# EAGLE design signal_mux (EAGLE 5.09)
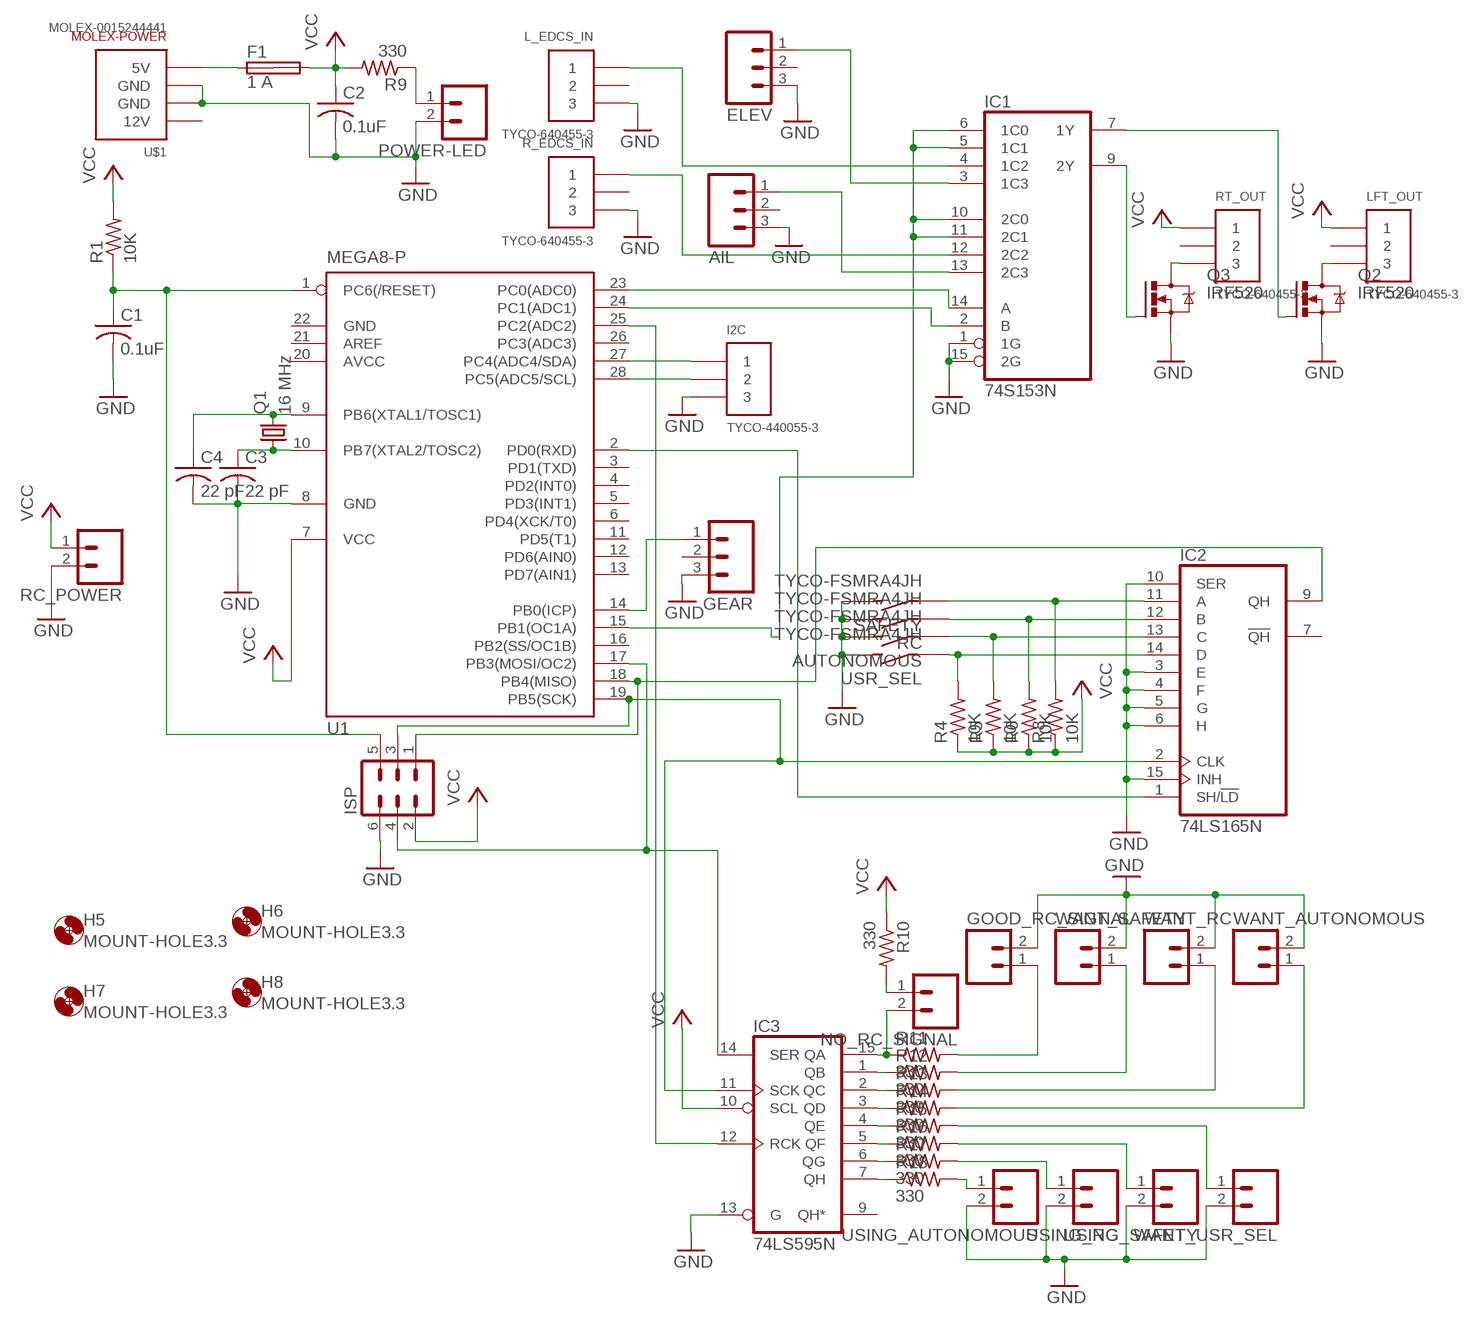
[diagram p0: schematic, sheet 1]

## Parts
AIL  M03POLAR  [MOLEX-1X3]
AUTONOMOUS  TYCO-FSMRA4JH  [TYCO-FSMRA4JH]
C1  0.1uF  C-US050-055X075  [C050-055X075]
C2  0.1uF  C-US050-055X075  [C050-055X075]
C3  22 pF  C-US025-025X050  [C025-025X050]
C4  22 pF  C-US025-025X050  [C025-025X050]
ELEV  M03POLAR  [MOLEX-1X3]
F1  1 A  SHK20Q  [SHK20Q]
GEAR  M03POLAR  [MOLEX-1X3]
GOOD_RC_SIGNAL  M02POLAR  [MOLEX-1X2]
H5  MOUNT-HOLE3.3  [3,3]
H6  MOUNT-HOLE3.3  [3,3]
H7  MOUNT-HOLE3.3  [3,3]
H8  MOUNT-HOLE3.3  [3,3]
I2C  TYCO-440055-3  [HEADER-RA-2.00MM-3]
IC1  74S153N  [DIL16]
IC2  74LS165N  [DIL16]
IC3  74LS595N  [DIL16]
ISP  MA03-2  [MA03-2]
L_EDCS_IN  TYCO-640455-3  [HEADER-RA-POL-.100IN-3]
LFT_OUT  TYCO-640455-3  [HEADER-RA-POL-.100IN-3]
NO_RC_SIGNAL  M02POLAR  [MOLEX-1X2]
POWER-LED  M02POLAR  [MOLEX-1X2]
Q1  16 MHz  CRYSTALHC49S  [HC49/S]
Q2  IRF520  [TO220BV]
Q3  IRF520  [TO220BV]
R1  10K  R-US_0207/10  [0207/10]
R4  10K  R-US_0207/10  [0207/10]
R5  10K  R-US_0207/10  [0207/10]
R6  10K  R-US_0207/10  [0207/10]
R8  10K  R-US_0207/10  [0207/10]
R9  330  R-US_0207/10  [0207/10]
R10  330  R-US_0207/10  [0207/10]
R11  330  R-US_0207/10  [0207/10]
R12  330  R-US_0207/10  [0207/10]
R13  330  R-US_0207/10  [0207/10]
R14  330  R-US_0207/10  [0207/10]
R15  330  R-US_0207/10  [0207/10]
R16  330  R-US_0207/10  [0207/10]
R17  330  R-US_0207/10  [0207/10]
R18  330  R-US_0207/10  [0207/10]
R_EDCS_IN  TYCO-640455-3  [HEADER-RA-POL-.100IN-3]
RC  TYCO-FSMRA4JH  [TYCO-FSMRA4JH]
RC_POWER  M02POLAR  [MOLEX-1X2]
RT_OUT  TYCO-640455-3  [HEADER-RA-POL-.100IN-3]
SAFETY  TYCO-FSMRA4JH  [TYCO-FSMRA4JH]
U1  MEGA8-P  [DIL28-3]
U$1  MOLEX-0015244441  [MOLEX-0015244441B]
USING_AUTONOMOUS  M02POLAR  [MOLEX-1X2]
USING_RC  M02POLAR  [MOLEX-1X2]
USING_SAFETY  M02POLAR  [MOLEX-1X2]
USR_SEL  TYCO-FSMRA4JH  [TYCO-FSMRA4JH]
WANT_AUTONOMOUS  M02POLAR  [MOLEX-1X2]
WANT_RC  M02POLAR  [MOLEX-1X2]
WANT_SAFETY  M02POLAR  [MOLEX-1X2]
WANT_USR_SEL  M02POLAR  [MOLEX-1X2]

## Nets
GND: AIL.3 AUTONOMOUS.2 C1.2 C2.2 C3.2 C4.2 ELEV.3 GEAR.3 GOOD_RC_SIGNAL.2 I2C.3 IC1.1(1G) IC1.15(2G) IC2.3(E) IC2.4(F) IC2.5(G) IC2.6(H) IC2.10(SER) IC2.15(INH) IC3.13(G) ISP.6 L_EDCS_IN.3 POWER-LED.2 Q2.S Q3.S R_EDCS_IN.3 RC.2 RC_POWER.2 SAFETY.2 U1.8(GND) U$1.2(GND) U$1.3(GND) USING_AUTONOMOUS.2 USING_RC.2 USING_SAFETY.2 USR_SEL.2 WANT_AUTONOMOUS.2 WANT_RC.2 WANT_SAFETY.2 WANT_USR_SEL.2
N$1: C1.1 ISP.5 R1.1 U1.1(PC6(/RESET))
N$2: NO_RC_SIGNAL.1 R10.2
N$3: IC3.15(QA) NO_RC_SIGNAL.2 R11.1
N$4: IC1.14(A) U1.23(PC0(ADC0))
N$5: GEAR.1 U1.14(PB0(ICP))
N$6: IC1.9(2Y) Q3.G
N$7: Q3.D RT_OUT.3
N$8: IC1.5(1C1) IC1.6(1C0) IC1.10(2C0) IC1.11(2C1) U1.15(PB1(OC1A))
N$9: IC2.1(SH/!LD) U1.2(PD0(RXD))
N$10: IC1.2(B) U1.24(PC1(ADC1))
N$11: IC1.4(1C2) L_EDCS_IN.1
N$12: IC1.12(2C2) R_EDCS_IN.1
N$13: AIL.1 IC1.13(2C3)
N$14: ELEV.1 IC1.3(1C3)
N$16: R18.2 USING_AUTONOMOUS.1
N$17: IC3.12(RCK) U1.25(PC2(ADC2))
N$18: LFT_OUT.3 Q2.D
N$20: R17.2 USING_RC.1
N$21: R16.2 USING_SAFETY.1
N$22: R15.2 WANT_USR_SEL.1
N$24: C3.1 Q1.1 U1.10(PB7(XTAL2/TOSC2))
N$25: IC2.14(D) R4.2 USR_SEL.1
N$26: AUTONOMOUS.1 IC2.13(C) R5.2
N$28: POWER-LED.1 R9.1
N$30: IC2.11(A) R8.2 SAFETY.1
N$31: C4.1 Q1.2 U1.9(PB6(XTAL1/TOSC1))
N$32: IC2.12(B) R6.2 RC.1
N$35: IC1.7(1Y) Q2.G
N$36: IC3.1(QB) R12.1
N$37: IC3.2(QC) R13.1
N$38: IC3.3(QD) R14.1
N$39: IC3.4(QE) R15.1
N$40: IC3.5(QF) R16.1
N$41: IC3.6(QG) R17.1
N$42: IC3.7(QH) R18.1
N$44: F1.1A U$1.4(5V)
N$48: R14.2 WANT_AUTONOMOUS.1
N$49: R13.2 WANT_RC.1
N$50: R12.2 WANT_SAFETY.1
N$51: GOOD_RC_SIGNAL.1 R11.2
N$55: I2C.1 U1.27(PC4(ADC4/SDA))
N$56: I2C.2 U1.28(PC5(ADC5/SCL))
N$65: IC2.9(QH) ISP.1 U1.18(PB4(MISO))
N$66: IC2.2(CLK) IC3.11(SCK) ISP.3 U1.19(PB5(SCK))
N$67: IC3.14(SER) ISP.4 U1.17(PB3(MOSI/OC2))
VCC: C2.1 F1.2A IC3.10(SCL) ISP.2 LFT_OUT.1 R1.2 R4.1 R5.1 R6.1 R8.1 R9.2 R10.1 RC_POWER.1 RT_OUT.1 U1.7(VCC)
Unconnected: AIL.2 ELEV.2 F1.1B F1.2B GEAR.2 IC2.7(!QH) IC3.9(QH*) L_EDCS_IN.2 LFT_OUT.2 R_EDCS_IN.2 RT_OUT.2 U1.3(PD1(TXD)) U1.4(PD2(INT0)) U1.5(PD3(INT1)) U1.6(PD4(XCK/T0)) U1.11(PD5(T1)) U1.12(PD6(AIN0)) U1.13(PD7(AIN1)) U1.16(PB2(SS/OC1B)) U1.21(AREF) U1.26(PC3(ADC3))

## Power pins joined to a net without a drawn wire
12V: U$1.1(12V)
AVCC: U1.20(AVCC)
GND: IC1.8(GND) IC2.8(GND) IC3.8(GND) U1.22(GND)
VCC: IC1.16(VCC) IC2.16(VCC) IC3.16(VCC)

## Library data of the parts
AIL ELEV GEAR = SparkFun:M03: Header 3 Standard 3-pin 0.1" header. Use with straight break away headers (SKU : PRT-00116), right angle break away headers (PRT-00553), swiss pins (PRT-00743), machine pins (PRT-00117), and female headers (PRT-00115). Molex polarized connector foot print use with SKU : PRT-08232 with associated crimp pins and housings.
AUTONOMOUS RC SAFETY USR_SEL = chicagoedt:TYCO-FSMRA4JH: Tyco Electronics FSMRA4JH tactile switch.
C1-C4 = resistor:C-US: CAPACITOR, American symbol
F1 = fuse:SHK20Q: FUSE HOLDER 5 x 20 mm, SH contact, E1207 Buerklin 64G6061
GOOD_RC_SIGNAL NO_RC_SIGNAL POWER-LED RC_POWER USING_AUTONOMOUS USING_RC USING_SAFETY WANT_AUTONOMOUS WANT_RC WANT_SAFETY WANT_USR_SEL = SparkFun:M02: Header 2 Standard 2-pin 0.1" header. Use with straight break away headers (SKU : PRT-00116), right angle break away headers (PRT-00553), swiss pins (PRT-00743), machine pins (PRT-00117), and female headers (PRT-00115). Molex polarized connector foot print use with SKU : PRT-08233 with associated crimp pins and housings.
H5-H8 = holes:MOUNT-HOLE: MOUNTING HOLE with drill center marker
I2C = chicagoedt:TYCO-440055-3: 3 pin right angle header with shroud and 2.00 mm pitch.
IC1 = 74xx-us:74*153: Dual 4-line to 1-line data SELECTOR/MULTIPLEXER
IC2 = 74xx-us:74*165: 8-bit parallel load SHIFT REGISTER
IC3 = 74xx-us:74*595: 8-bit SHIFT REGISTER, output latch
ISP = con-lstb:MA03-2: PIN HEADER
L_EDCS_IN LFT_OUT R_EDCS_IN RT_OUT = chicagoedt:TYCO-640455-3: 3 pin right angle header with polarizing tab and .100" pitch.
Q1 = crystal:CRYSTAL: CRYSTAL
Q2 Q3 = transistor-power:IRF520: HEXFET Power MOSFET
R1 R4-R6 R8-R18 = resistor:R-US_: RESISTOR, American symbol
U1 = atmel:MEGA8-P: MICROCONTROLLER 8 Kbytes FLASH, 1 kbytes SRAM, 512 bytes EEPROM, USART, 4-channel 10 bit ADC, 2-channel 8 bit ADC Pin compatible with Atmega48, ATMega88, ATMega168 Source: avr.lbr
U$1 = chicagoedt:MOLEX-0015244441: 5.08mm (.200") Pitch Disk Drive Power Connection System Header, Right Angle, Through Hole, 4 Circuits, Lead-free, 3.56mm (.140") PC Tail Length, with PCB Locator Peg

## Board
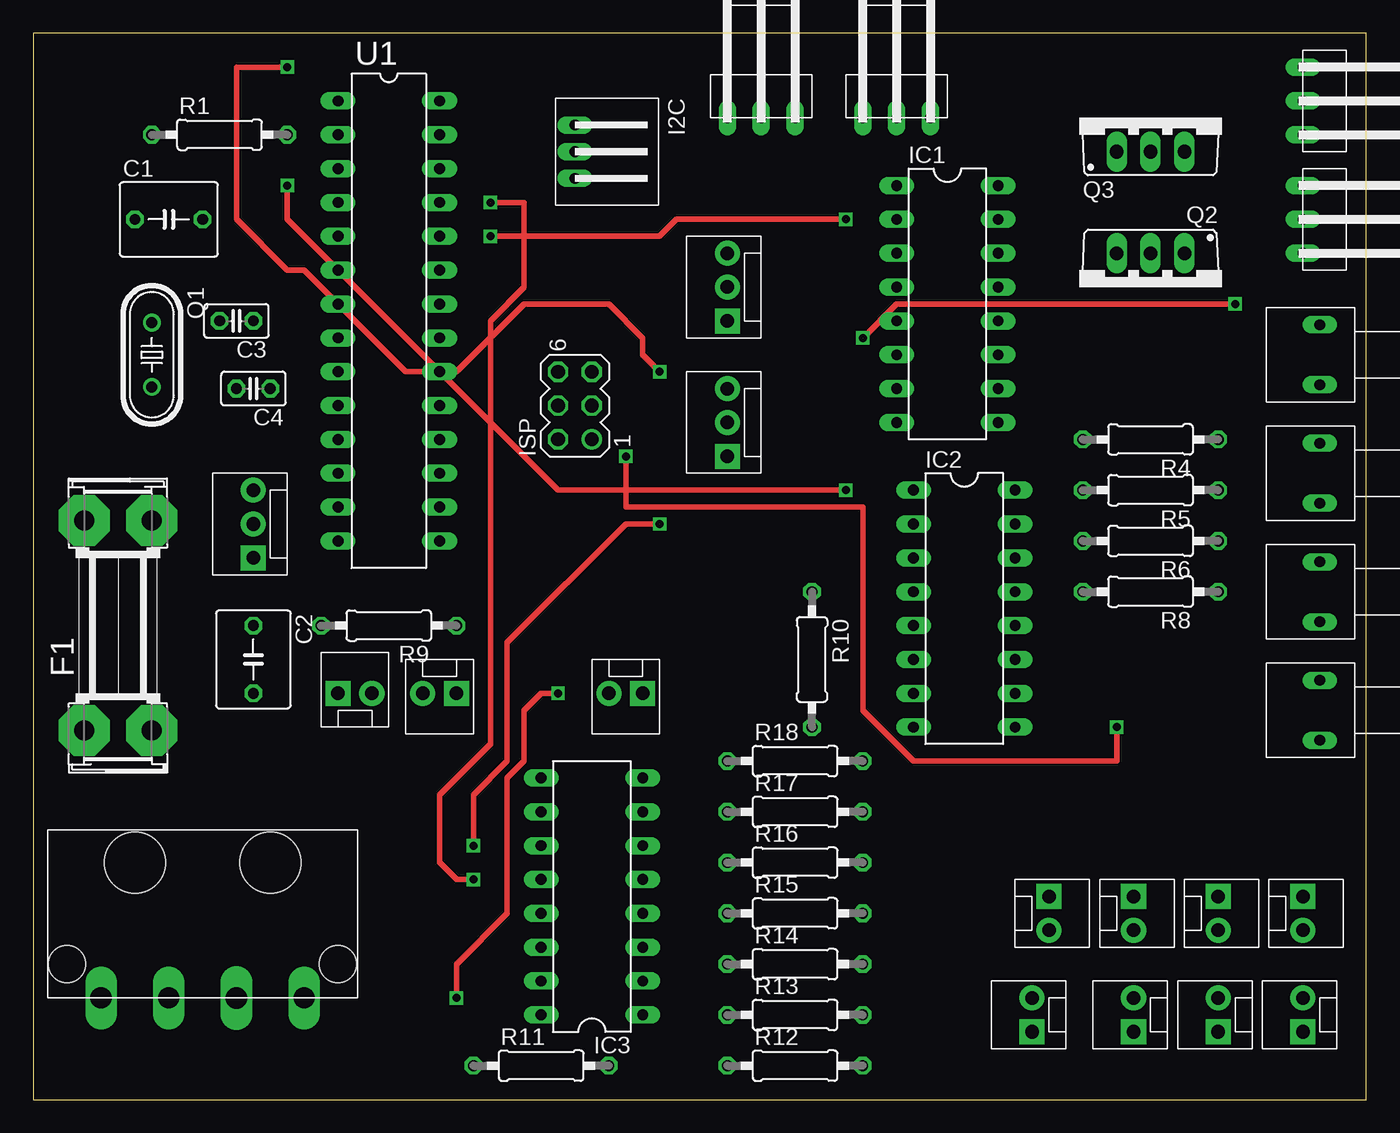
[diagram p1: board, top side]
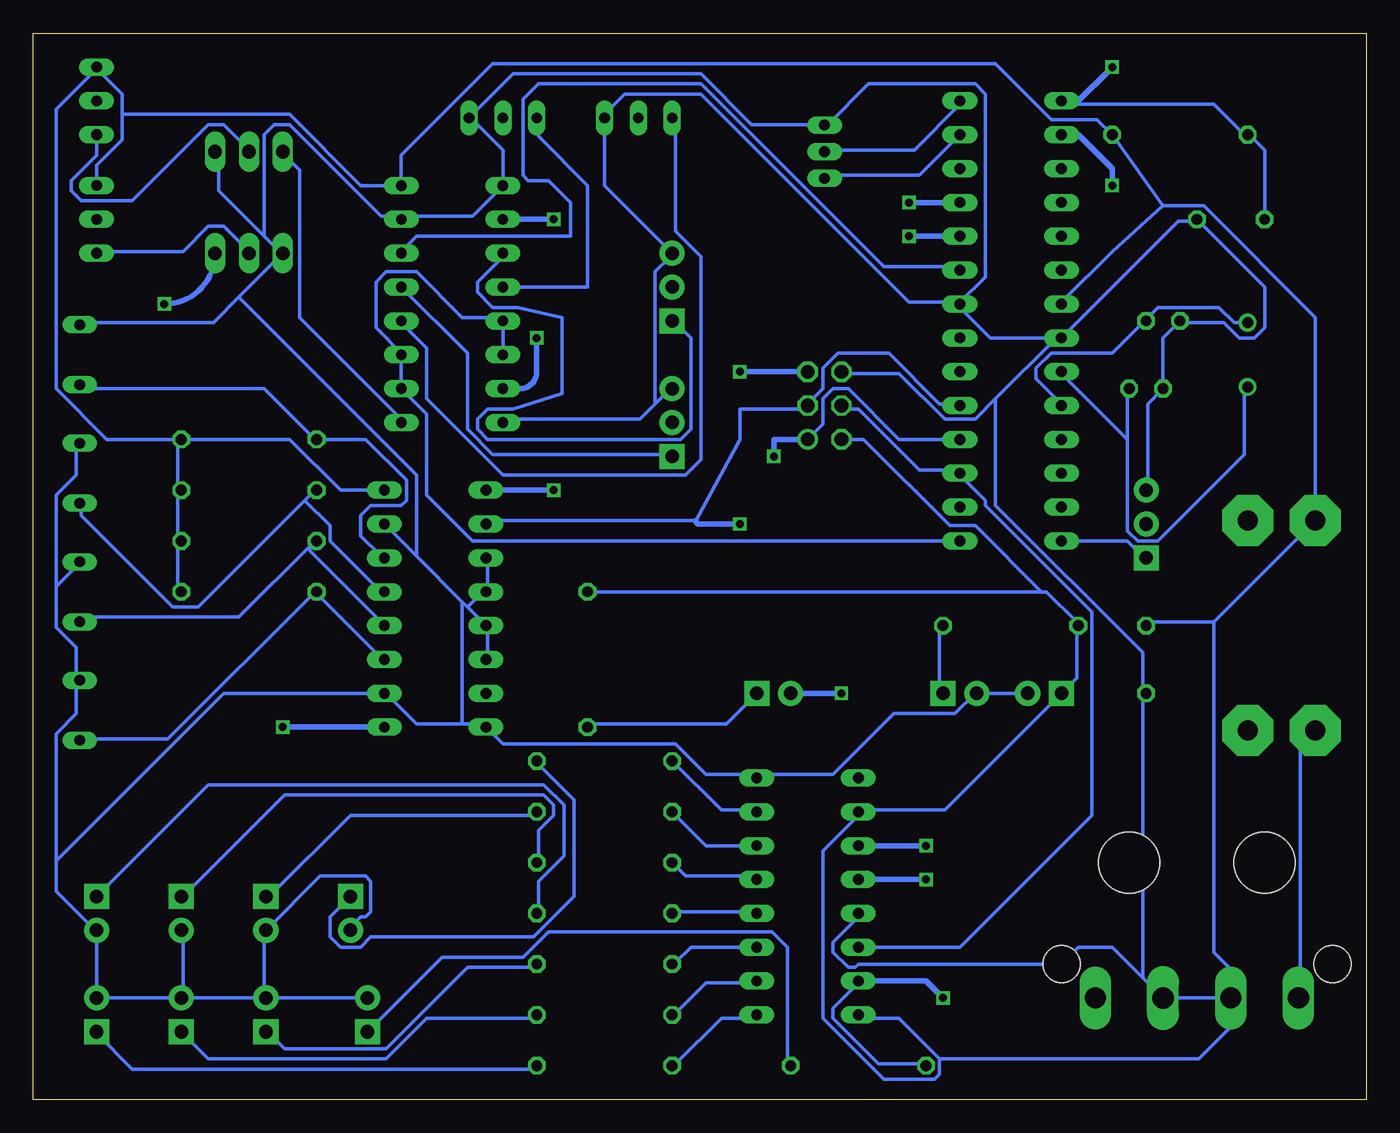
[diagram p2: board, bottom side, seen from below]

Size 100 x 80 mm. Coordinates in mm from the lower left corner, seen from the top.
Outline: 0,0 100,0 100,80 0,80 0,0
Copper layers (1*16): Top 0.035mm / dielectric 1.5mm / Bottom 0.035mm
Design rules "default": minimum track width 10mil, minimum drill 24mil, track to track 8mil, track to pad 8mil, pad to pad 8mil, via to via 8mil, smd to smd 8mil, copper to edge 40mil, drill to drill 8mil, minimum pad ring 10mil, minimum via ring 8mil, stop-mask expansion 4mil, vias tented up to drill 0mil, thermal gap 10mil

### Footprints (pad centres in the part's own frame; a part is rotated, then mirrored left to right if it is on the bottom)
MOLEX-1X3 = drill 1.016 pad 1.88 square: 1 0,0 | drill 1.016 pad 1.88 round: 2 2.54,0; 3 5.08,0
TYCO-FSMRA4JH = drill 0.8 long: 1 -2.25,0; 2 2.25,0
C050-055X075 = drill 0.813 octagon: 1 -2.54,0; 2 2.54,0
C025-025X050 = drill 0.813 octagon: 1 -1.27,0; 2 1.27,0
SHK20Q = drill 1.5 pad 3.81 octagon: 1A -7.874,2.54; 1B -7.874,-2.54; 2A 7.874,2.54; 2B 7.874,-2.54
MOLEX-1X2 = drill 1.016 pad 1.88 square: 1 0,0 | drill 1.016 pad 1.88 round: 2 2.54,0
3,3 = hole 3.3: 0,0
HEADER-RA-2.00MM-3 = drill 0.8 long: 1 2,0; 2 0,0; 3 -2,0
DIL16 = drill 0.813 long: 1 -8.89,-3.81; 2 -6.35,-3.81; 3 -3.81,-3.81; 4 -1.27,-3.81; 5 1.27,-3.81; 6 3.81,-3.81; 7 6.35,-3.81; 8 8.89,-3.81; 9 8.89,3.81; 10 6.35,3.81; 11 3.81,3.81; 12 1.27,3.81; 13 -1.27,3.81; 14 -3.81,3.81; 15 -6.35,3.81; 16 -8.89,3.81
MA03-2 = drill 1.016 round: 1 -2.54,-1.27 | drill 1.016 octagon: 2 -2.54,1.27; 3 0,-1.27; 4 0,1.27; 5 2.54,-1.27; 6 2.54,1.27
HEADER-RA-POL-.100IN-3 = drill 0.8 long: 1 -2.54,-5.08; 2 0,-5.08; 3 2.54,-5.08
HC49/S = drill 0.813 round: 1 -2.413,0; 2 2.413,0
TO220BV = drill 1.016 long: D 0,-2.54; G -2.54,-2.54; S 2.54,-2.54
0207/10 = drill 0.813 octagon: 1 -5.08,0; 2 5.08,0
DIL28-3 = drill 0.813 long: 1 -16.51,-3.81; 2 -13.97,-3.81; 3 -11.43,-3.81; 4 -8.89,-3.81; 5 -6.35,-3.81; 6 -3.81,-3.81; 7 -1.27,-3.81; 8 1.27,-3.81; 9 3.81,-3.81; 10 6.35,-3.81; 11 8.89,-3.81; 12 11.43,-3.81; 13 13.97,-3.81; 14 16.51,-3.81; 15 16.51,3.81; 16 13.97,3.81; 17 11.43,3.81; 18 8.89,3.81; 19 6.35,3.81; 20 3.81,3.81; 21 1.27,3.81; 22 -1.27,3.81; 23 -3.81,3.81; 24 -6.35,3.81; 25 -8.89,3.81; 26 -11.43,3.81; 27 -13.97,3.81; 28 -16.51,3.81
MOLEX-0015244441B = drill 1.587 pad 1.778 long: 1 7.62,-6.35; 3 -2.54,-6.35; 4 -7.62,-6.35 | drill 1.6 pad 1.651 long: 2 2.54,-6.35 | hole 2.794: -10.16,-3.81; 10.16,-3.81 | hole 4.572: -5.08,3.81; 5.08,3.81

### Placement (x,y rotation side)
AIL  52.07,48.26 90 top
AUTONOMOUS  96.52,46.99 90 top
C1  10.16,66.04 0 top
C2  16.51,33.02 270 top
C3  15.24,58.42 180 top
C4  16.51,53.34 180 top
ELEV  52.07,58.42 90 top
F1  6.35,35.56 90 top
GEAR  16.51,40.64 90 top
GOOD_RC_SIGNAL  74.93,5.08 90 top
H5  -62.23,64.77 0 top  (outside the outline)
H6  -71.12,64.77 0 top  (outside the outline)
H7  -80.01,64.77 0 top  (outside the outline)
H8  -17.78,74.93 0 top  (outside the outline)
I2C  40.64,71.12 270 top
IC1  68.58,59.69 270 top
IC2  69.85,36.83 270 top
IC3  41.91,15.24 90 top
ISP  40.64,52.07 90 top
L_EDCS_IN  64.77,78.74 0 top
LFT_OUT  100.33,66.04 270 top
NO_RC_SIGNAL  45.72,30.48 180 top
POWER-LED  31.75,30.48 180 top
Q1  8.89,55.88 270 top
Q2  83.82,60.96 180 top
Q3  83.82,73.66 0 top
R1  13.97,72.39 0 top
R4  83.82,49.53 180 top
R5  83.82,45.72 180 top
R6  83.82,41.91 180 top
R8  83.82,38.1 180 top
R9  26.67,35.56 180 top
R10  58.42,33.02 270 top
R11  38.1,2.54 0 top
R12  57.15,2.54 0 top
R13  57.15,6.35 0 top
R14  57.15,10.16 0 top
R15  57.15,13.97 0 top
R16  57.15,17.78 0 top
R17  57.15,21.59 0 top
R18  57.15,25.4 0 top
R_EDCS_IN  54.61,78.74 0 top
RC  96.52,38.1 90 top
RC_POWER  22.86,30.48 0 top
RT_OUT  100.33,74.93 270 top
SAFETY  96.52,29.21 90 top
U1  26.67,58.42 270 top
U$1  12.7,13.97 0 top
USING_AUTONOMOUS  76.2,15.24 270 top
USING_RC  82.55,15.24 270 top
USING_SAFETY  88.9,15.24 270 top
USR_SEL  96.52,55.88 90 top
WANT_AUTONOMOUS  82.55,5.08 90 top
WANT_RC  88.9,5.08 90 top
WANT_SAFETY  95.25,5.08 90 top
WANT_USR_SEL  95.25,15.24 270 top

### Tracks (layer width: path | path; a pad name or v marks a point on that pad's centre or on a via)
GND
  Bottom 0.254: U$1.3 U$1.2 16.76,9.14 | 16.76,9.14 19.05,11.43 21.59,11.43 22.86,10.16 38.1,10.16 38.35,9.91 38.86,9.91 40.01,11.05 40.01,11.81 38.1,13.72 IC3.13 | 16.76,9.14 16.76,30.48 | 53.34,52.2 52.2,53.34 AIL.3 | 53.34,52.2 54.48,51.05 64.77,51.05 IC1.8 | 53.34,52.2 53.34,62.1 52.2,63.25 ELEV.3 57.15,68.58 R_EDCS_IN.3 57.15,73.91 55.63,75.44 49.91,75.44 34.29,59.82 30.48,59.82 | GEAR.3 16.38,45.72 16.38,52.2 C4.2 15.24,57.15 C3.2 13.72,58.29 10.67,58.29 9.53,57.15 8.38,57.15 7.62,57.91 7.62,60.96 C1.2 12.95,65.91 14.1,65.91 U1.8 23.24,57.15 | 23.24,57.15 28.19,57.15 30.48,59.44 U1.22 30.48,59.82 | 27.81,52.58 23.24,57.15 | 27.81,52.58 29.34,51.05 31.62,51.05 35.05,54.48 39.24,54.48 ISP.6 | 16.76,30.48 16.76,33.53 27.81,44.58 27.81,52.58 | 16.76,30.48 C2.2 | 72.39,66.29 67.06,66.29 IC1.1 64.77,71.25 67.06,73.53 L_EDCS_IN.3 64.01,76.96 49.91,76.96 46.1,73.15 40.77,73.15 I2C.3 40.39,73.15 37.34,76.2 29.34,76.2 28.57,75.44 28.57,61.72 30.48,59.82 | 84.58,60.2 86.49,58.29 96.39,58.29 USR_SEL.2 | 84.58,60.2 Q2.S 81.53,63.63 82.68,64.77 | 82.68,64.77 86.11,68.2 86.11,70.87 Q3.S | 45.72,24.38 40.01,24.38 35.43,28.96 30.86,28.96 29.34,30.48 POWER-LED.2 RC_POWER.2 | 67.82,28.19 71.25,28.19 73.53,30.48 IC2.10 85.72,30.48 98.3,17.91 | 67.82,28.19 66.29,28.19 IC2.8 64.77,26.67 51.82,26.67 49.53,24.38 45.72,24.38 | IC2.3 65.91,40.39 65.91,38.1 IC2.4 66.29,38.1 67.44,36.96 | IC2.6 65.91,33.15 65.91,35.43 IC2.5 67.44,36.96 | 67.82,37.34 67.44,36.96 | 71.25,40.77 67.82,37.34 | 71.25,40.77 IC2.15 | 67.82,37.34 67.82,28.19 | 98.3,38.48 98.3,35.43 96.77,33.91 96.77,31.62 SAFETY.2 96.77,31.24 96.77,28.96 98.3,27.43 98.3,17.91
  Bottom 0.254: 98.3,38.48 96.77,40.01 RC.2 | 98.3,38.48 98.3,45.34 96.77,46.86 96.77,49.15 AUTONOMOUS.2 | USING_AUTONOMOUS.2 76.2,12.95 75.44,13.72 75.06,13.72 74.68,14.1 74.68,16.38 75.06,16.76 78.49,16.76 USING_RC.2 82.68,12.57 82.68,7.62 | 95.25,12.57 WANT_SAFETY.2 WANT_RC.2 88.77,7.62 | 88.77,7.62 88.77,12.57 USING_SAFETY.2 | GOOD_RC_SIGNAL.2 WANT_AUTONOMOUS.2 82.68,7.62 | 88.77,7.62 82.68,7.62 | 98.3,17.91 98.3,15.62 95.25,12.57 | 95.25,12.57 WANT_USR_SEL.2 | 45.72,24.38 IC3.8 | 84.58,60.2 71.25,46.86 71.25,40.77 | 72.39,66.29 73.91,66.29 80.77,73.15 81.92,73.15 82.68,72.39 82.68,64.77 | 72.39,66.29 IC1.15
N$1  (via drill 0.6)
  Top 0.406: v19.05,77.47 15.24,77.47 15.24,66.04 19.05,62.23 20.32,62.23 27.94,54.61 31.75,54.61 36.83,59.69 43.18,59.69 45.72,57.15 45.72,55.88 v46.99,54.61
  Bottom 0.254: C1.1 7.62,71.25 8.76,72.39 R1.1 9.14,72.39 11.43,74.68 22.86,74.68 U1.1
  Bottom 0.406: 22.86,74.68 21.84,74.68 v19.05,77.47 | v46.99,54.61 ISP.5
N$2
  Bottom 0.254: NO_RC_SIGNAL.1 48.01,28.19 58.29,28.19 R10.2
N$3  (via drill 0.6)
  Top 0.406: v31.75,7.62 31.75,10.16 35.56,13.97 35.56,24.13 36.83,25.4 36.83,29.21 38.1,30.48 v39.37,30.48
  Bottom 0.254: R11.1 33.15,2.67 36.58,2.67 40.01,6.1 40.01,6.86 38.1,8.76 IC3.15
  Bottom 0.406: IC3.15 33.02,8.89 v31.75,7.62 | v39.37,30.48 NO_RC_SIGNAL.2
N$4
  Bottom 0.254: U1.23 30.48,62.48 36.2,62.48 49.91,76.2 62.1,76.2 63.25,75.06 63.25,69.34 62.87,68.96 61.34,68.96 59.69,67.31 59.69,64.77 71.25,64.77 72.39,63.63 IC1.14
N$5
  Bottom 0.254: U1.14 17.91,41.91 16.76,40.77 GEAR.1
N$6
  Bottom 0.254: IC1.9 72.39,51.05 80.01,58.67 80.01,69.72 81.15,70.87 Q3.G
N$7
  Bottom 0.254: RT_OUT.3 95.25,70.87 97.16,68.96 97.16,68.2 96.39,67.44 92.58,67.44 86.87,73.15 85.72,73.15 83.82,71.25 Q3.D
N$8
  Bottom 0.254: IC1.6 IC1.5 64.77,58.67 67.82,58.67 71.25,62.1 73.53,62.1 74.3,61.34 74.3,57.91 72.39,56.01 IC1.11 IC1.10 70.48,51.44 70.48,45.34 67.06,41.91 U1.15
N$9  (via drill 0.6)
  Top 0.406: v60.96,45.72 39.37,45.72 19.05,66.04 v19.05,68.58
  Bottom 0.406: U1.2 21.59,72.39 19.05,69.85 v19.05,68.58 | v60.96,45.72 IC2.1
N$10  (via drill 0.6)  (1 unrouted)
  Top 0.406: v34.29,64.77 46.99,64.77 48.26,66.04 60.96,66.04
  Bottom 0.406: U1.24 v34.29,64.77 | 60.96,66.04 IC1.2
N$11
  Bottom 0.254: IC1.4 58.42,60.96 58.42,68.58 62.1,72.26 62.1,73.53 L_EDCS_IN.1
N$12
  Bottom 0.254: R_EDCS_IN.1 51.82,73.53 51.82,65.15 49.91,63.25 49.91,48.01 51.05,46.86 64.77,46.86 70.48,52.58 70.48,56.39 72.39,58.29 IC1.12
N$13
  Bottom 0.254: IC1.13 67.44,56.01 67.44,50.29 65.53,48.39 52.2,48.39 AIL.1
N$14
  Bottom 0.254: IC1.3 64.77,63.25 66.67,61.34 66.67,60.58 65.53,59.44 63.63,59.44 60.33,58.67 60.33,52.96 64.01,51.82 65.91,51.82 66.67,51.05 66.67,50.29 65.91,49.53 51.44,49.53 50.67,50.29 50.67,57.15 51.82,58.29 ELEV.1
N$15  (via drill 0.6)
  other vias: 81.28,27.94
N$16
  Bottom 0.254: USING_AUTONOMOUS.1 77.72,13.72 77.72,12.19 76.96,11.43 75.44,11.43 74.68,12.19 62.48,12.19 59.44,15.24 59.44,22.48 62.1,25.15 R18.2
N$17  (via drill 0.6)  (1 unrouted)
  Top 0.406: v33.02,16.51 31.75,16.51 30.48,17.78 30.48,22.86 34.29,26.67 34.29,58.42 36.83,60.96 36.83,67.31 34.29,67.31
  Bottom 0.406: v33.02,16.51 IC3.12 | U1.25 34.29,67.31
N$18
  Bottom 0.254: LFT_OUT.3 95.25,63.63 88.77,63.63 86.87,65.53 85.72,65.53 83.82,63.63 Q2.D
N$19  (via drill 0.6)
  other vias: 39.37,30.48
N$20
  Bottom 0.254: R17.2 62.48,21.34 76.2,21.34 82.3,15.24 USING_RC.1
N$21
  Bottom 0.254: R16.2 62.1,17.91 62.1,20.19 60.96,21.34 60.96,22.1 61.72,22.86 81.15,22.86 88.77,15.24 USING_SAFETY.1
N$22
  Bottom 0.254: WANT_USR_SEL.1 86.87,23.62 61.72,23.62 60.2,22.1 60.2,18.29 62.1,16.38 62.1,14.1 R15.2
N$23  (via drill 0.6)
  other vias: 46.99,43.18
N$24
  Bottom 0.254: Q1.1 9.91,58.29 11.05,59.44 15.62,59.44 16.38,58.67 C3.1 16.76,58.29 19.05,56.01 23.62,56.01 24.77,54.86 24.77,54.1 22.86,52.2 U1.10
N$25
  Bottom 0.254: USR_SEL.1 96.39,53.34 82.68,53.34 78.87,49.53 R4.2 75.06,49.53 72.01,46.48 72.01,44.96 72.39,44.58 74.68,44.58 75.44,43.81 75.44,42.29 73.91,40.77 IC2.14
N$26
  Bottom 0.254: 79.63,44.96 78.87,45.72 R5.2 | 79.63,44.96 87.63,36.96 89.53,36.96 96.39,43.81 96.39,44.58 AUTONOMOUS.1 | 79.63,44.96 77.72,43.05 77.72,41.91 73.91,38.1 IC2.13
N$27  (via drill 0.6)
  other vias: 19.05,77.47
N$28
  Bottom 0.254: R9.1 32,35.43 32,30.48 POWER-LED.1
N$29  (via drill 0.6)
  other vias: 34.29,67.31
N$30
  Bottom 0.254: 78.87,38.1 89.92,27.05 96.39,27.05 SAFETY.1 | 78.87,38.1 73.91,33.15 IC2.11 | 78.87,38.1 R8.2
N$31
  Bottom 0.254: 17.91,49.53 17.91,53.34 C4.1 | 17.91,49.53 17.91,42.67 17.14,41.91 15.62,41.91 9.14,48.39 9.14,53.34 Q1.2 | 17.91,49.53 22.86,54.48 U1.9
N$32
  Bottom 0.254: 79.25,41.53 78.87,41.91 R6.2 79.25,41.53 | 79.25,41.53 84.58,36.2 96.39,36.2 RC.1 | 79.25,41.53 79.25,41.15 IC2.12
N$33  (via drill 0.6)
  other vias: 34.29,64.77
N$34  (via drill 0.6)
  other vias: 33.02,16.51
N$35  (via drill 0.6)  (1 unrouted)
  Top 0.406: v90.17,59.69 64.77,59.69 62.23,57.15
  Bottom 0.406: IC1.7 63.5,53.34 arc-90 62.23,54.61 62.23,57.15 | v90.17,59.69 arc-90 Q2.G
N$36
  Bottom 0.254: IC3.1 45.72,6.1 48.39,6.1 51.82,2.67 R12.1
N$37
  Bottom 0.254: IC3.2 45.72,8.76 49.53,8.76 51.82,6.48 R13.1
N$38
  Bottom 0.254: IC3.3 50.67,11.43 51.82,10.29 R14.1
N$39
  Bottom 0.254: IC3.4 45.72,14.1 51.82,14.1 R15.1
N$40
  Bottom 0.254: IC3.5 45.72,16.76 51.05,16.76 R16.1
N$41
  Bottom 0.254: IC3.6 49.53,19.05 R17.1
N$42
  Bottom 0.254: IC3.7 45.72,21.72 48.39,21.72 R18.1
N$43  (via drill 0.6)
  other vias: 33.02,19.05
N$44
  Bottom 0.254: U$1.4 4.95,7.62 4.95,26.29 3.81,27.43 F1.1A
N$45  (via drill 0.6)
  other vias: 60.96,66.04
N$46  (via drill 0.6)
  other vias: 62.23,57.15
N$48
  Bottom 0.254: R14.2 62.48,9.91 67.44,9.91 73.53,3.81 81.15,3.81 82.3,4.95 WANT_AUTONOMOUS.1
N$49
  Bottom 0.254: R13.2 62.48,6.1 70.48,6.1 73.53,3.05 86.87,3.05 WANT_RC.1
N$50
  Bottom 0.254: R12.2 62.48,2.29 92.58,2.29 95.25,4.95 WANT_SAFETY.1
N$51
  Bottom 0.254: R11.2 43.43,2.67 43.43,11.43 44.58,12.57 61.34,12.57 63.25,10.67 69.34,10.67 GOOD_RC_SIGNAL.1
N$55
  Bottom 0.254: U1.27 33.53,69.34 40.39,69.34 I2C.1
N$56
  Bottom 0.254: I2C.2 40.39,71.25 33.91,71.25 30.48,74.68 U1.28
N$65  (via drill 0.6)
  Top 0.406: v81.28,27.94 81.28,25.4 66.04,25.4 62.23,29.21 62.23,44.45 44.45,44.45 v44.45,48.26
  Bottom 0.254: U1.18 35.05,49.53 38.86,53.34 40.01,53.34 40.77,52.58 40.77,50.67 ISP.1
  Bottom 0.406: ISP.1 44.45,49.53 v44.45,48.26 | IC2.9 v81.28,27.94
N$66  (via drill 0.6)  (1 unrouted)
  Top 0.406: v33.02,19.05 33.02,22.86 35.56,25.4 35.56,34.29 44.45,43.18 46.99,43.18
  Bottom 0.254: U1.19 30.48,52.2 32,52.2 35.81,56.01 39.62,56.01 40.77,54.86 40.77,53.34 41.91,52.2 ISP.3 41.91,51.82 46.99,51.82 46.99,49.53 50.29,43.43 65.91,43.43 IC2.2
  Bottom 0.406: 50.29,43.43 arc-90 50.04,43.18 46.99,43.18 | v33.02,19.05 IC3.11
N$67
  Bottom 0.254: IC3.14 30.48,11.43 20.57,21.34 20.57,36.58 28.57,44.58 28.57,44.96 30.48,46.86 U1.17 30.48,47.24 33.53,47.24 38.1,51.82 39.24,51.82 ISP.4
VCC
  Bottom 0.254: 89.15,41.91 89.15,38.1 R8.1 | IC2.16 76.96,45.72 80.77,49.53 R4.1 89.15,49.53 | 89.15,49.53 89.15,45.72 | 89.15,45.72 89.15,41.91 | 89.15,41.91 R6.1 | 89.15,45.72 R5.1 | LFT_OUT.1 95.25,70.1 93.34,72.01 93.34,73.91 | 93.34,73.91 93.34,75.44 95.25,77.34 | 93.34,73.91 80.77,73.91 75.44,68.58 IC1.16 72.39,70.87 65.53,77.72 27.81,77.72 23.62,73.53 20.19,73.53 R1.2 15.24,67.06 | 89.15,49.53 94.49,49.53 98.3,53.34 98.3,74.3 95.25,77.34 | 95.25,77.34 RT_OUT.1 | 15.24,67.06 19.05,63.63 22.86,59.82 U1.7 | 11.43,35.81 16.38,35.81 C2.1 | 11.43,35.81 F1.2A 3.81,58.67 12.19,67.06 15.24,67.06 | 32,3.05 35.05,6.1 38.1,6.1 IC3.16 | 32,3.05 32,1.91 32.38,1.52 36.2,1.52 40.77,6.1 40.77,18.67 38.1,21.34 IC3.10 38.1,21.72 31.62,21.72 RC_POWER.1 21.72,31.62 21.72,35.43 R9.2 21.72,35.81 24,38.1 24.38,38.1 | 24.38,38.1 R10.1 | 24.38,38.1 29.34,43.05 31.24,43.05 37.72,49.53 ISP.2 | 11.43,35.81 11.43,11.05 9.14,8.76 9.14,6.48 12.57,3.05 32,3.05